# Altium project LM3886 Amplifier Prototype.PrjPcb
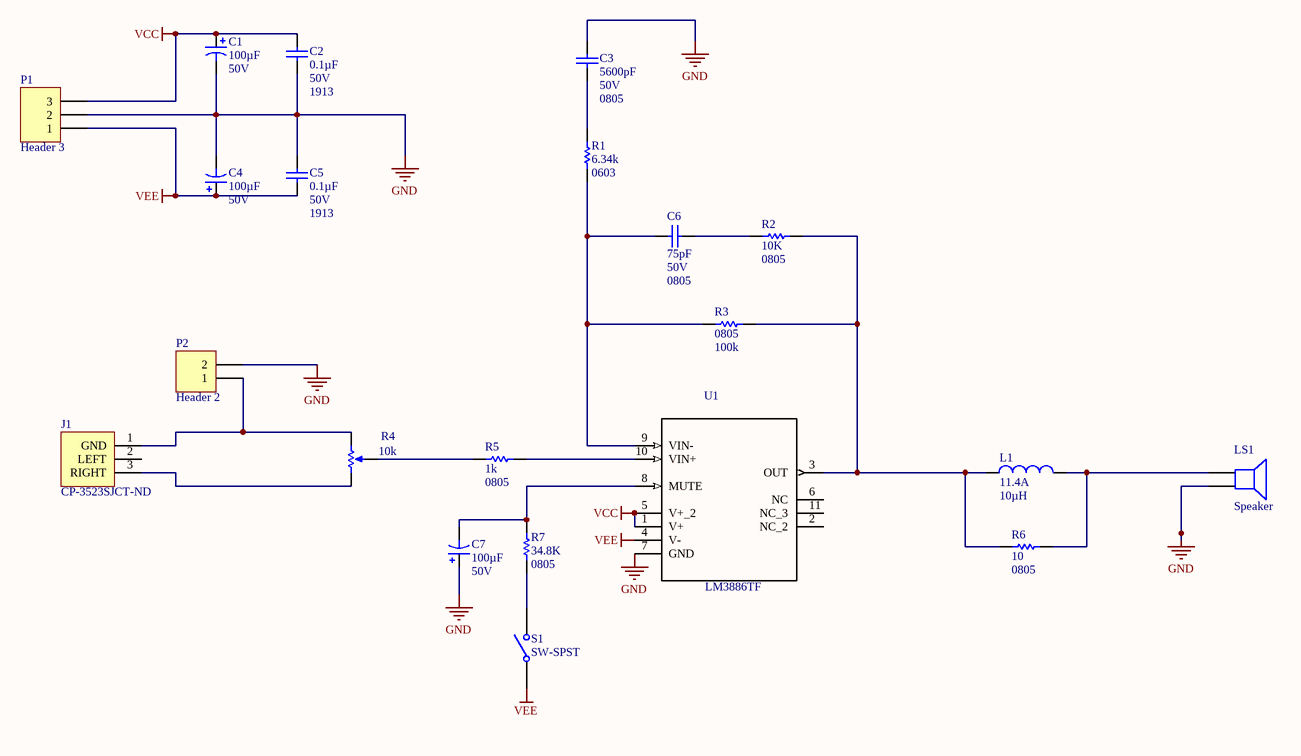
[diagram p0: Main.SchDoc]
1 sheet, 21 parts. Net scope: global (net labels, ports and power ports of the same name join across sheets).
Board file: Prototype Board V1.PcbDoc

## Sheet Main.SchDoc
size A4

### Parts
C1  Capacitance: 100µF  Voltage - Rated: 50V  [CAPAE109103X103M]  (hidden comment: UUQ1H101MCL1GS)
C2  Capacitance: 0.1µF  Voltage Rating - DC: 50V  Package / Case: 1913  [CAP1913]  (hidden comment: ECH-U1H104JX9)
C3  Capacitance: 5600pF  Voltage - Rated: 50V  Package: 0805  [CAP0805]  (hidden comment: C2012C0G1H562J060AA)
C4  Capacitance: 100µF  Voltage - Rated: 50V  [CAPAE109103X103M]  (hidden comment: UUQ1H101MCL1GS)
C5  Capacitance: 0.1µF  Voltage Rating - DC: 50V  Package / Case: 1913  [CAP1913]  (hidden comment: ECH-U1H104JX9)
C6  Capacitance: 75pF  Voltage - Rated: 50V  Package: 0805  [CAP0805]  (hidden comment: C0805C750J5GAC7800)
C7  Capacitance: 100µF  Voltage - Rated: 50V  [CAPAE109103X103M]  (hidden comment: UUQ1H101MCL1GS)
J1  Supplier Part Number 1: CP-3523SJCT-ND  [CONN JACK STEREO 3.5MM SMD R/A]  (hidden comment: SJ-3523-SMT-TR)
L1  Current Rating: 11.4A  Inductance: 10µH  [Shielded Toroidal Inductor]  (hidden comment: 2100LL-100-V-RC)
LS1  Speaker  [PIN2]
P1  Header 3  [HDR1X3]
P2  Header 2  [HDR1X2]
R1  Resistance: 6.34k  Package: 0603  [RES0603]  (hidden comment: RT0603DRD076K34L)
R2  Resistance: 10K  Package: 0805  [RES0805]  (hidden comment: RT0805BRE0710KL)
R3  Package: 0805  Resistance: 100k  [RES0805]  (hidden comment: ERA-6AEB104V)
R4  value 10k  [VR5]  (hidden comment: RPot)
R5  Resistance: 1k  Package: 0805  [RES0805]  (hidden comment: RT0805FRE071KL)
R6  Resistance: 10  Package: 0805  [RES0805]  (hidden comment: RNCP0805FTD10R0)
R7  Resistance: 34.8K  Package: 0805  [RES0805]  (hidden comment: RT0805DRD0734K8L)
S1  SW-SPST  [SPST-2]
U1  LM3886TF  [AMP_LM3886T]

### Nets
GND: C1.2 C2.1 C3.2 C4.2 C5.2 C7.1 LS1.2 P1.2 P2.2 U1.7(GND)
VCC: C1.1 C2.2 P1.3 U1.1(V+) U1.5(V+_2)
VEE: C4.1 C5.1 P1.1 S1.1(COMMON) U1.4(V-)
NetC3_1: C3.1 R1.2
NetC6_1: C6.1 R1.1 R3.1 U1.9(VIN-)
NetC6_2: C6.2 R2.1
NetC7_2: C7.2 R7.2 U1.8(MUTE)
NetJ1_1: J1.1(GND) P2.1 R4.2(BOT)
NetJ1_3: J1.3(RIGHT) R4.1(TOP)
NetL1_1: L1.1 R2.2 R3.2 R6.1 U1.3(OUT)
NetL1_2: L1.2 LS1.1 R6.2
NetR4_3: R4.3(TAP) R5.1
NetR5_2: R5.2 U1.10(VIN+)
NetR7_1: R7.1 S1.2(NO)

Not connected (* = marked no-connect by the designer): J1 2(LEFT); U1 2(NC_2) 6(NC) 11(NC_3)

### Library data of the parts
C1 C4 C7 = UUQ1H101MCL1GS: CAP ALUM 100UF 20% 50V SMD; Supplier 1: Digi-Key; Supplier Part Number 1: 493-3209-1-ND; Tolerance: ±20%
C2 C5 = ECH-U1H104JX9: CAP FILM 0.1UF 5% 50VDC 1913; Supplier 1: Digi-Key; Supplier Part Number 1: PCF1561CT-ND; Tolerance: ±5%
C3 = C2012C0G1H562J060AA: CAP CER 5600PF 50V C0G 0805; Temperature Coefficient: C0G, NP0; Supplier 1: Digi-Key; Supplier Part Number 1: 445-7513-1-ND; Features: Low ESL
C6 = C0805C750J5GAC7800: CAP CER 75PF 50V NP0 0805; Supplier 1: Digi-Key; Supplier Part Number 1: 399-14632-1-ND; Features: Low ESL
J1 = SJ-3523-SMT-TR: CONN JACK STEREO 3.5MM SMD R/A; Supplier 1: Digi-Key
L1 = 2100LL-100-V-RC: FIXED IND 10UH 11.4A 5 MOHM TH; Tolerance: ±15%; DC Resistance (DCR): 5 mOhm Max; Shielding: Shielded; Supplier 1: Digi-Key; Supplier Part Number 1: 2100LL-100-V-RC-ND
LS1 = Speaker: Loudspeaker; Published: 24-Mar-1999; LatestRevisionDate: 17-Jul-2002; LatestRevisionNote: Re-released for DXP Platform.; PackageReference: PIN2; Publisher: Altium Limited
P1 = Header 3: Header, 3-Pin; LatestRevisionDate: 17-Jul-2002; LatestRevisionNote: Re-released for DXP Platform.; Publisher: Altium Limited
P2 = Header 2: Header, 2-Pin; LatestRevisionDate: 17-Jul-2002; LatestRevisionNote: Re-released for DXP Platform.; Publisher: Altium Limited
R1 = RT0603DRD076K34L: RES SMD 6.34KOHM 0.5% 1/10W 0603; Supplier 1: Digi-Key; Supplier Part Number 1: 311-6.34KDCT-ND
R2 = RT0805BRE0710KL: RES SMD 10K OHM 0.1% 1/8W 0805; Supplier 1: Digi-Key; Supplier Part Number 1: YAG2327CT-ND
R3 = ERA-6AEB104V: RES SMD 100K OHM 0.1% 1/8W 0805; Supplier 1: Digi-Key; Supplier Part Number 1: P100KDACT-ND
R4 = RPot: Potentiometer; Sim Note: Enter the Resistance value and the set point into parameter fields.; Set Position: 0.5; Published: 8-Jun-2000; LatestRevisionDate: 17-Jul-2002; LatestRevisionNote: Re-released for DXP Platform.; PackageReference: VR5; Publisher: Altium Limited; PackageDescription: Variable Resistor, Thru-Hole; 3 Leads
R5 = RT0805FRE071KL: RES SMD 1K OHM 1% 1/8W 0805; Supplier 1: Digi-Key; Supplier Part Number 1: YAG1240CT-ND
R6 = RNCP0805FTD10R0: RES 10 OHM 1% 1/4W 0805; Tolerance: ±1%; Supplier 1: Digi-Key; Supplier Part Number 1: RNCP0805FTD10R0CT-ND
R7 = RT0805DRD0734K8L: RES SMD 34.8K OHM 0.5% 1/8W 0805; Supplier 1: Digi-Key; Supplier Part Number 1: 311-2737-1-ND
S1 = SW-SPST: Single-Pole, Single-Throw Switch; Published: 24-Mar-1999; LatestRevisionDate: 17-Jul-2002; LatestRevisionNote: Re-released for DXP Platform.; PackageReference: SPST-2; Publisher: Altium Limited; PackageDescription: Switch; 2 Leads
U1 = LM3886TF: MF: Texas; Price: None; SnapEDA_Link: https://www.snapeda.com/symbols-footprints/LM3886TF/Texas%20Instruments/view-part/?ref=snap; Availability: Unavailable; Package: TO-220-11 Texas; MP: LM3886TF; Value: *